# EAGLE design delay_v02 (EAGLE 5.07)
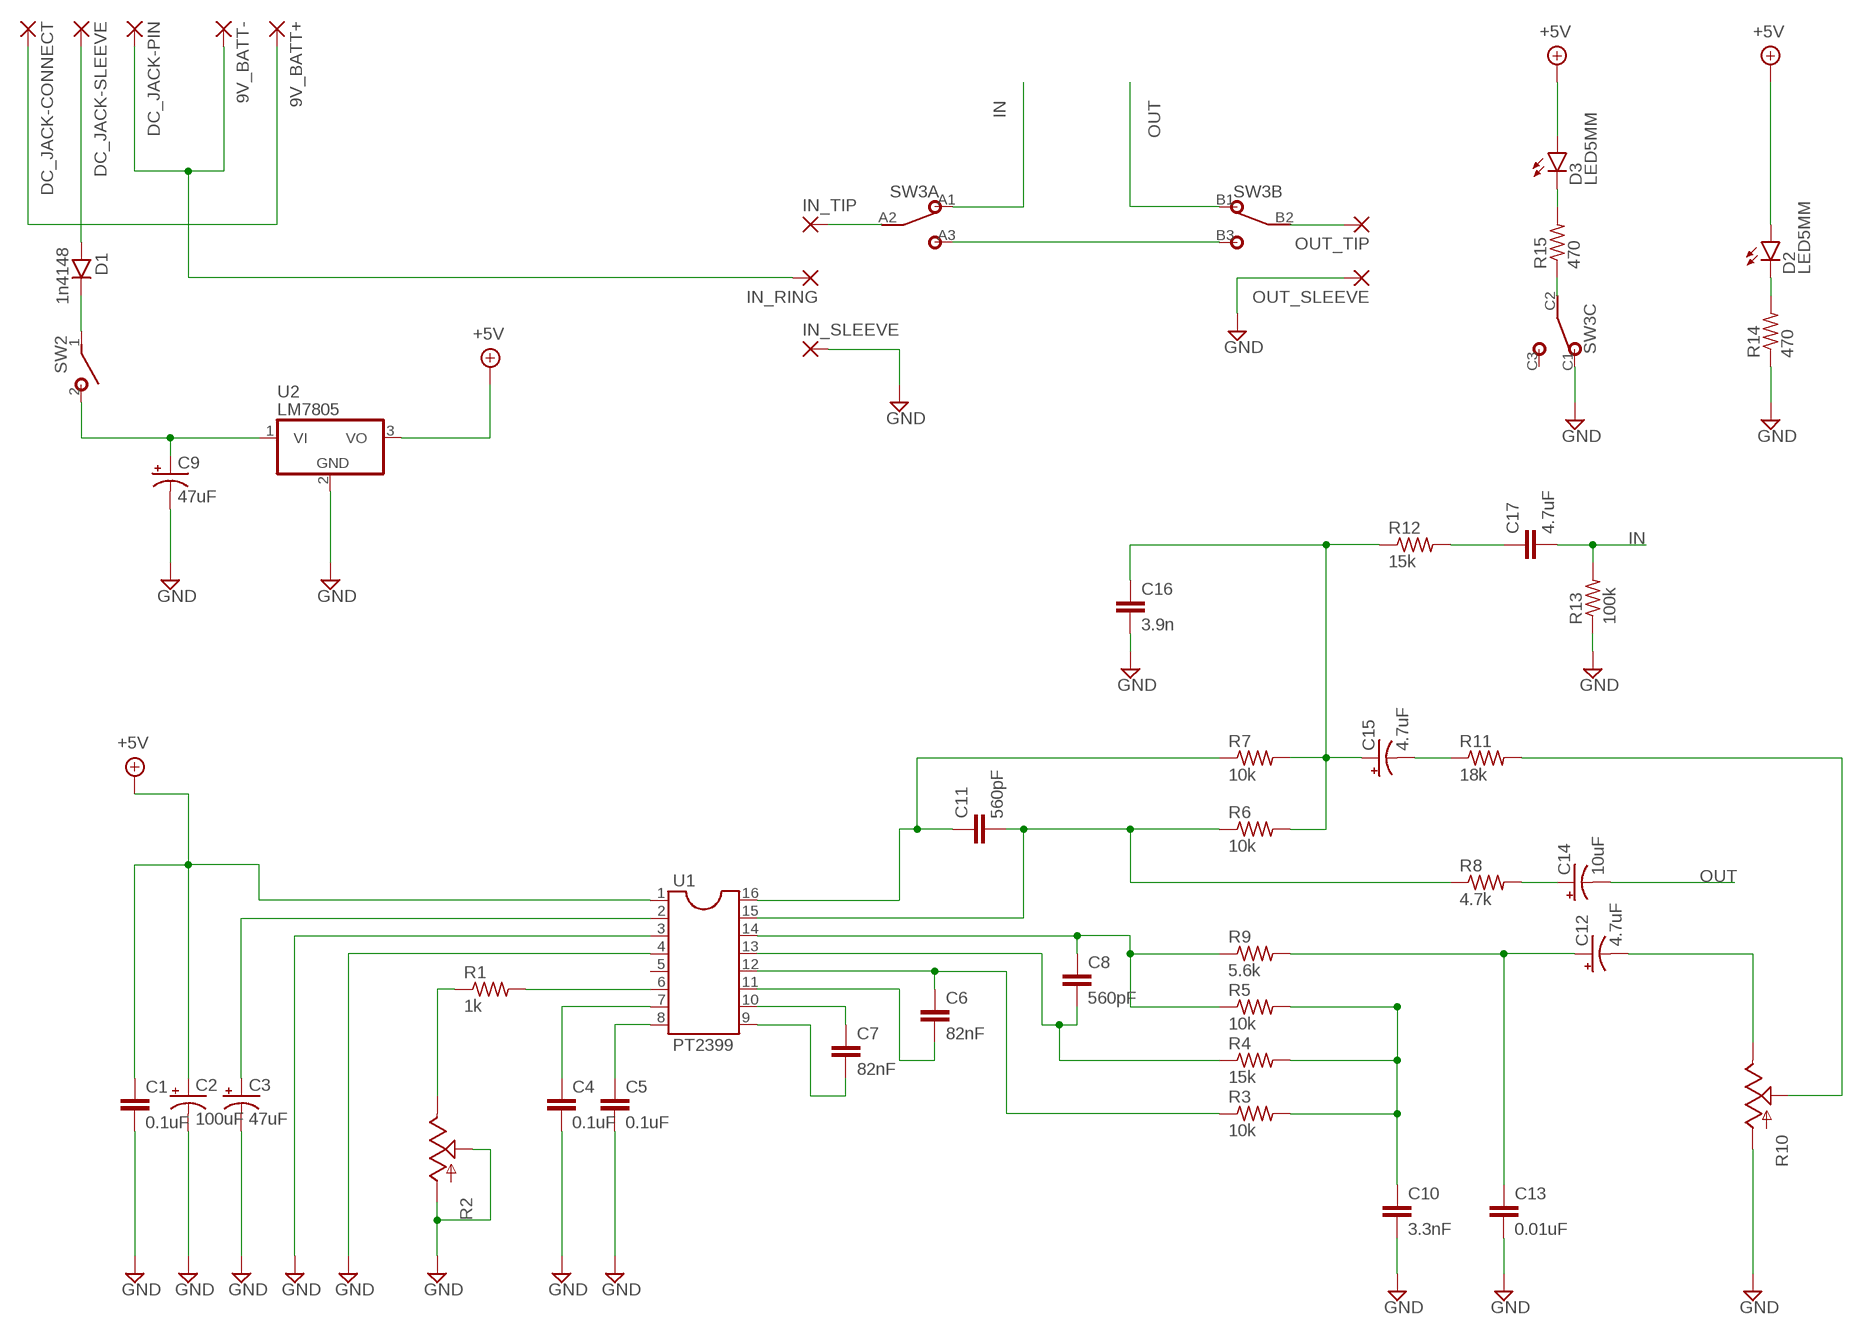
[diagram p0: schematic, sheet 1]

## Parts
9V_BATT+  3,17/1,1  [3,17/1,1]
9V_BATT-  3,17/1,1  [3,17/1,1]
C1  0.1uF  050X030_0251  [050X030_025]
C2  100uF  0631  [063_025]
C3  47uF  0631  [063_025]
C4  0.1uF  050X030_0251  [050X030_025]
C5  0.1uF  050X030_0251  [050X030_025]
C6  82nF  050X030_0251  [050X030_025]
C7  82nF  050X030_0251  [050X030_025]
C8  560pF  050X030_0251  [050X030_025]
C9  47uF  0631  [063_025]
C10  3.3nF  050X030_0251  [050X030_025]
C11  560pF  050X030_0251  [050X030_025]
C12  4.7uF  0631  [063_025]
C13  0.01uF  050X030_0251  [050X030_025]
C14  10uF  0631  [063_025]
C15  4.7uF  0631  [063_025]
C16  3.9n  050X030_0251  [050X030_025]
C17  4.7uF  050X030_0251  [050X030_025]
D1  1n4148  1N400X.3  [DO41-3]
D2  LED5MM  [LED5MM]
D3  LED5MM  [LED5MM]
DC_JACK-CONNECT  3,17/1,1  [3,17/1,1]
DC_JACK-PIN  3,17/1,1  [3,17/1,1]
DC_JACK-SLEEVE  3,17/1,1  [3,17/1,1]
IN_RING  3,17/1,1  [3,17/1,1]
IN_SLEEVE  3,17/1,1  [3,17/1,1]
IN_TIP  3,17/1,1  [3,17/1,1]
OUT_SLEEVE  3,17/1,1  [3,17/1,1]
OUT_TIP  3,17/1,1  [3,17/1,1]
R1  1k  3MM.3  [R0204/3]
R2  50k  POT  [ALPS_POT]
R3  10k  3MM.3  [R0204/3]
R4  15k  3MM.3  [R0204/3]
R5  10k  3MM.3  [R0204/3]
R6  10k  3MM.3  [R0204/3]
R7  10k  3MM.3  [R0204/3]
R8  4.7k  3MM.3  [R0204/3]
R9  5.6k  3MM.3  [R0204/3]
R10  20k  POT  [ALPS_POT]
R11  18k  3MM.3  [R0204/3]
R12  15k  3MM.3  [R0204/3]
R13  100k  3MM.3  [R0204/3]
R14  470  3MM.3  [R0204/3]
R15  470  3MM.3  [R0204/3]
SW2  SPST  [SPST]
SW3  3PDT  [3PDT]
U1  PT2399  DIL16S  [SOCKET-16]
U2  LM7805  78  [TO92-]

## Nets
C5*: C5.1 U1.8
GND: C1.2 C2.- C3.- C4.2 C5.2 C9.- C10.2 C13.2 C16.2 IN_SLEEVE.1(P) OUT_SLEEVE.1(P) R2.P$2(S) R2.P$3(A) R10.P$3(A) R13.1 R14.1 SW3.C1 U1.3 U1.4 U2.2(GND)
IN: C17.2 R13.2 SW3.A1
N$1: C17.1 R12.2
N$2: C4.1 U1.7
N$3: C7.2 U1.9
N$4: C7.1 U1.10
N$5: C10.1 R3.2 R4.2 R5.2
N$6: C6.1 R3.1 U1.12
N$7: R1.2 U1.6
N$8: R1.1 R2.P$1(E)
N$9: C3.+ U1.2
N$10: R15.1 SW3.C2
N$12: C8.2 R4.1 U1.13
N$13: D3.K(C) R15.2
N$14: C11.2 R6.1 R8.1 U1.15
N$15: C11.1 R7.1 U1.16
N$16: C12.+ C13.1 R9.2
N$17: C6.2 U1.11
N$18: SW3.A3 SW3.B3
N$19: C12.- R10.P$1(E)
N$20: C15.+ C16.1 R6.2 R7.2 R12.1
N$21: C15.- R11.1
N$22: R10.P$2(S) R11.2
N$23: OUT_TIP.1(P) SW3.B2
N$24: IN_TIP.1(P) SW3.A2
N$25: C14.+ R8.2
N$26: C8.1 R5.1 R9.1 U1.14
N$29: D2.K(C) R14.2
N$30: D1.A DC_JACK-SLEEVE.1(P)
N$31: D1.C SW2.1(P)
N$32: 9V_BATT-.1(P) DC_JACK-PIN.1(P) IN_RING.1(P)
N$33: 9V_BATT+.1(P) DC_JACK-CONNECT.1(P)
N$34: C9.+ SW2.2(S) U2.1(VI)
OUT: C14.- SW3.B1
VA: C1.1 C2.+ D2.A D3.A U1.1 U2.3(VO) ; supply symbol labelled +5V
Unconnected: SW3.C3 U1.5

## Library data of the parts
9V_BATT+ 9V_BATT- DC_JACK-CONNECT DC_JACK-PIN DC_JACK-SLEEVE IN_RING IN_SLEEVE IN_TIP OUT_SLEEVE OUT_TIP = wirepad:3,17/1,1: THROUGH-HOLE PAD
C1 C4-C8 C10 C11 C13 C16 C17 = gm-caps-ceramic:050X030_025: 47 - 120pF Xicon Ceramic Disc 2.5mm lead spacing
C2 C3 C9 C12 C14 C15 = gm-caps-electro-pol:063: 33 - 220uF Xicon values at Mouser.com 10V: 220uF; 16V: 100uF; 25V: 100uF; 50V: 33uF
D1 = gm-diodes:1N400X: Rectifier Diodes often used in power supply to prevent damage from reverse polarization
D2 D3 = gm-diodes:LED
R1 R3-R9 R11-R15 = gm-resistors:3MM: 3mm Resistors Leads spaced 1-6 holes apart for 0.1" perfboard. Suitable for 1/8 watt resistors.
R2 R10 = SparkFun-3-2-07:POT
SW2 = gm-switches:SPST
SW3 = gm-switches:3PDT
U1 = ic-package:DIL16: Dual In Line / Socket
U2 = gm-regulators:78*: Positive VOLTAGE REGULATOR Source: http://cache.national.com/ds/LM/LM78L05.pdf http://www.fairchildsemi.com/ds/LM/LM7805.pdf

## Board
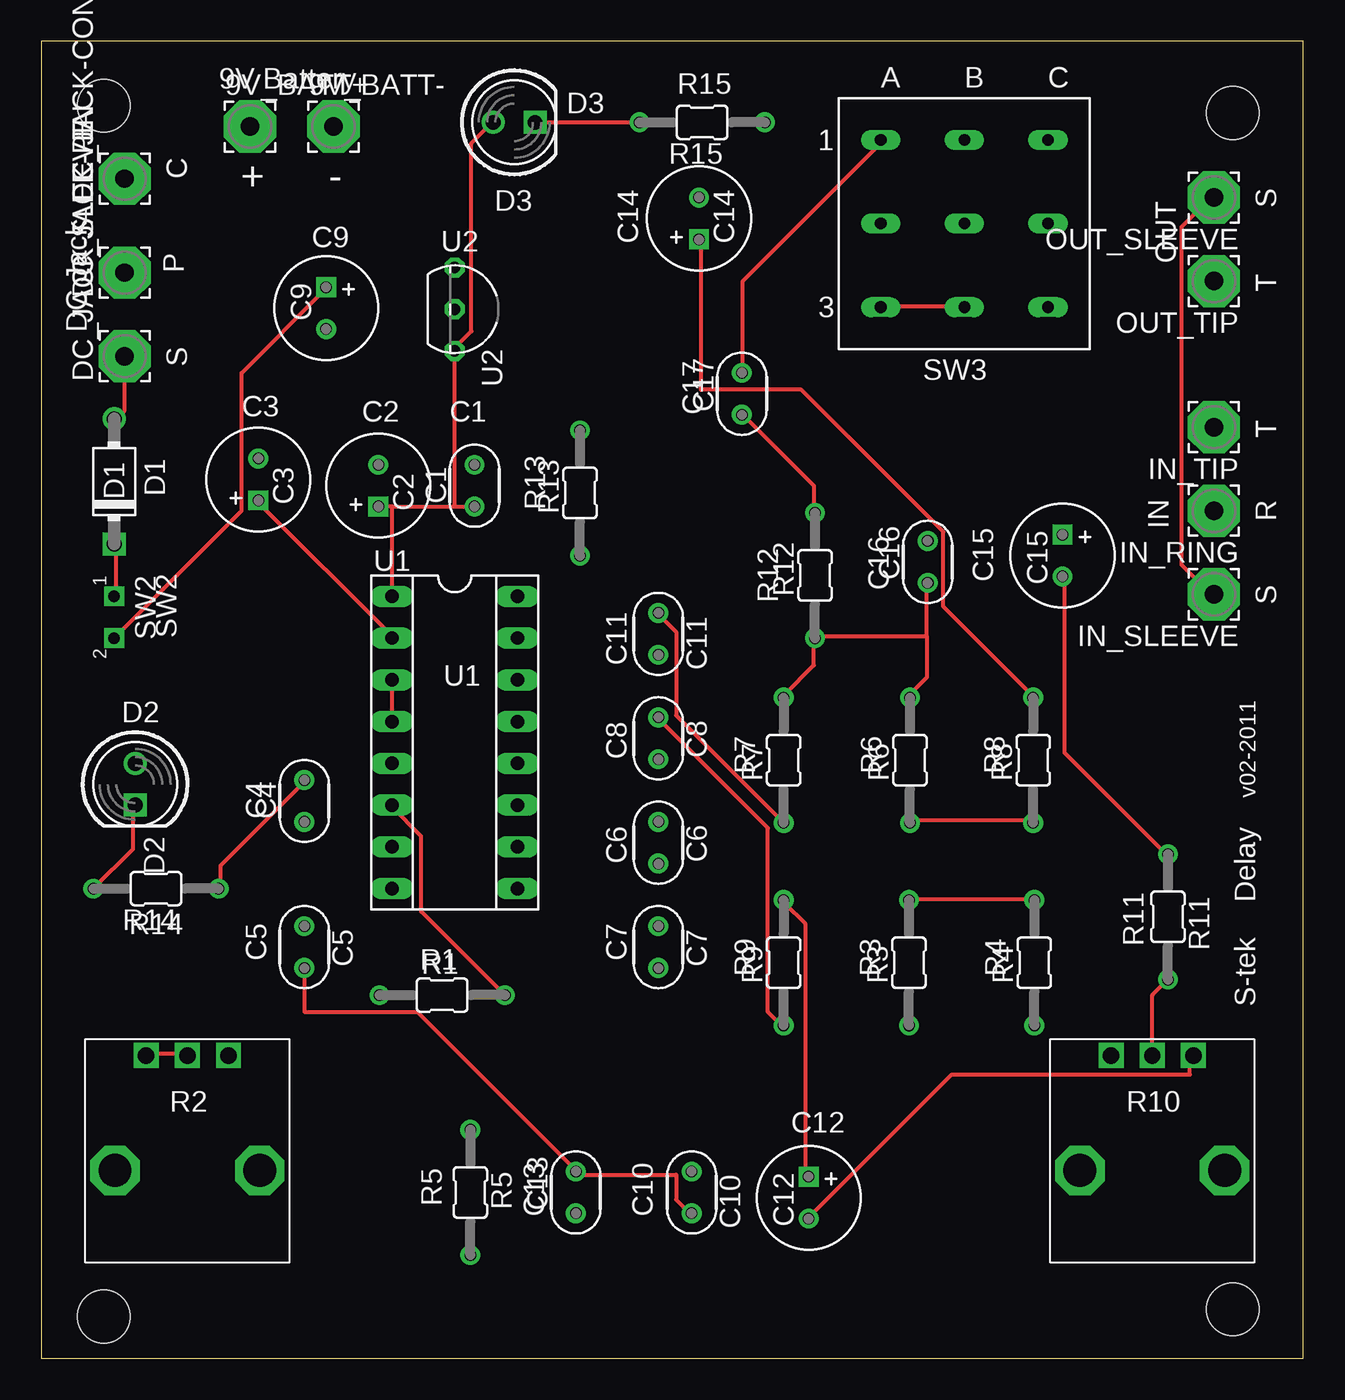
[diagram p1: board, top side]
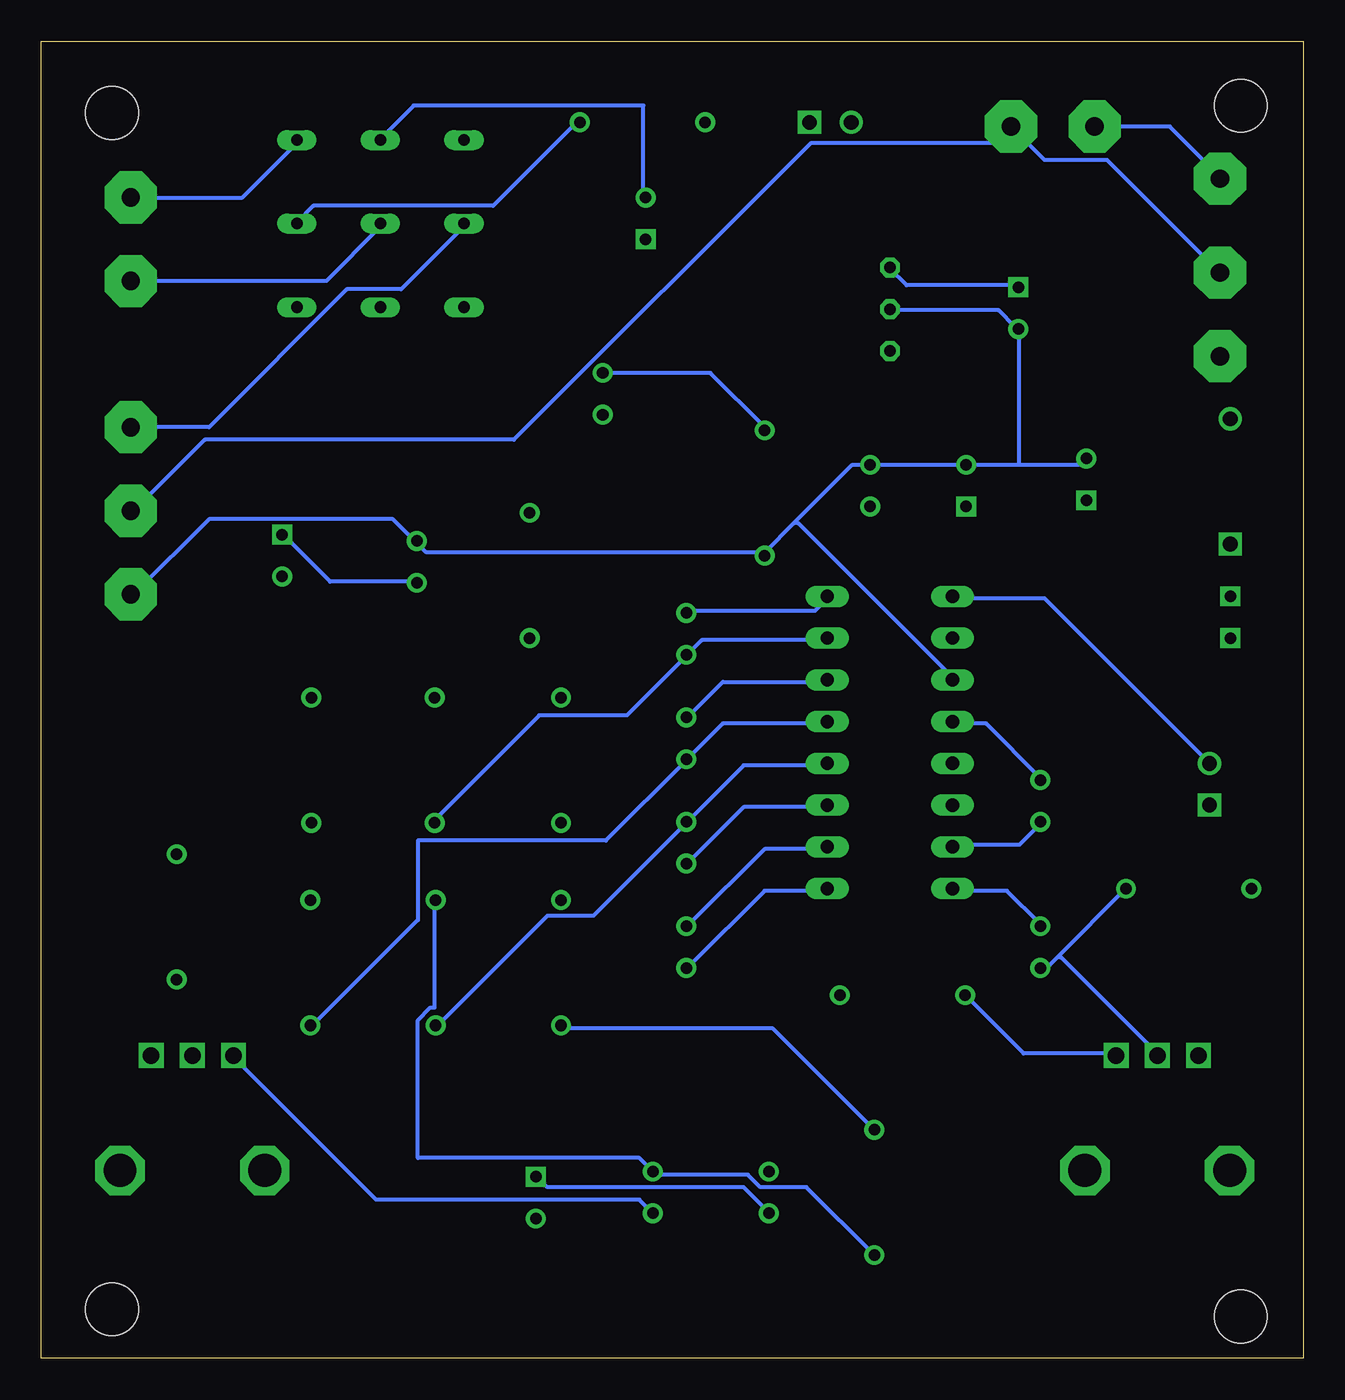
[diagram p2: board, bottom side, seen from below]

Size 76.76 x 80.13 mm. Coordinates in mm from the lower left corner, seen from the top.
Outline: 0,0 76.76,0 76.76,80.13 0,80.13 0,0
Copper layers (1*16): Top 0.035mm / dielectric 1.5mm / Bottom 0.035mm
Design rules "default *": minimum track width 10mil, minimum drill 24mil, track to track 12mil, track to pad 8mil, pad to pad 8mil, via to via 8mil, smd to smd 8mil, copper to edge 40mil, drill to drill 8mil, minimum pad ring 10mil, minimum via ring 8mil, stop-mask expansion 4mil, vias tented up to drill 0mil, thermal gap 10mil
Holes 3.2 mm at 3.81,76.2 72.45,75.76 72.45,2.98 3.81,2.54

### Footprints (pad centres in the part's own frame; a part is rotated, then mirrored left to right if it is on the bottom)
3,17/1,1 = drill 1.118 pad 3.175 octagon: 1 0,0
050X030_025 = drill 0.7 round: 1 -1.27,0; 2 1.27,0
063_025 = drill 0.7 square: + -1.27,0 | drill 0.7 round: - 1.27,0
DO41-3 = drill 0.9 round: A 3.81,0 | drill 0.9 square: C -3.81,0
LED5MM = drill 0.9 round: A -1.27,0 | drill 0.9 square: K 1.27,0
R0204/3 = drill 0.7 round: 1 -3.81,0; 2 3.81,0
ALPS_POT = drill 1 square: P$1 7,-2.5; P$2 7,0; P$3 7,2.5 | drill 2 octagon: P$4 0,-4.4; P$5 0,4.4
SPST = drill 0.7 square: 1 -1.27,0; 2 1.27,0
3PDT = drill 0.7 long: A1 -5.08,5.08; A2 -5.08,0; A3 -5.08,-5.08; B1 0,5.08; B2 0,0; B3 0,-5.08; C1 5.08,5.08; C2 5.08,0; C3 5.08,-5.08
SOCKET-16 = drill 0.813 long: 1 -8.89,-3.81; 2 -6.35,-3.81; 3 -3.81,-3.81; 4 -1.27,-3.81; 5 1.27,-3.81; 6 3.81,-3.81; 7 6.35,-3.81; 8 8.89,-3.81; 9 8.89,3.81; 10 6.35,3.81; 11 3.81,3.81; 12 1.27,3.81; 13 -1.27,3.81; 14 -3.81,3.81; 15 -6.35,3.81; 16 -8.89,3.81
TO92- = drill 0.7 octagon: 1 -2.54,0; 2 0,0; 3 2.54,0

### Placement (x,y rotation side)
9V_BATT+  12.7,74.93 0 top
9V_BATT-  17.78,74.93 0 top
C1  26.35,53.09 90 top
C2  20.51,53.09 90 top
C3  13.21,53.47 90 top
C4  16,33.91 90 top
C5  16,25.02 270 top
C6  37.53,31.37 270 top
C7  37.53,25.02 270 top
C8  37.53,37.72 270 top
C9  17.34,63.88 270 top
C10  39.56,10.1 270 top
C11  37.53,44.07 270 top
C12  46.67,9.78 270 top
C13  32.51,10.1 90 top
C14  40.01,69.34 90 top
C15  62.1,48.83 270 top
C16  53.91,48.45 90 top
C17  42.61,58.67 90 top
D1  4.45,53.34 90 top
D2  5.71,34.92 270 top
D3  28.77,75.18 0 top
DC_JACK-CONNECT  5.08,71.75 90 top
DC_JACK-PIN  5.08,66.04 90 top
DC_JACK-SLEEVE  5.08,60.96 90 top
IN_RING  71.31,51.56 180 top
IN_SLEEVE  71.31,46.48 180 top
IN_TIP  71.31,56.64 180 top
OUT_SLEEVE  71.31,70.61 180 top
OUT_TIP  71.31,65.53 180 top
R1  24.38,22.1 0 top
R2  8.89,11.43 90 top
R3  52.77,24.07 90 top
R4  60.39,24.07 90 top
R5  26.1,10.1 270 top
R6  52.83,36.39 90 top
R7  45.15,36.39 90 top
R8  60.33,36.39 90 top
R9  45.15,24.07 90 top
R10  67.56,11.43 90 top
R11  68.52,26.86 270 top
R12  47.05,47.62 90 top
R13  32.77,52.64 90 top
R14  6.99,28.57 180 top
R15  40.2,75.18 180 top
SW2  4.45,45.09 270 top
SW3  56.13,69.02 0 top
U1  25.15,37.47 270 top
U2  25.15,63.82 270 top

### Tracks (layer width: path | path; a pad name or v marks a point on that pad's centre or on a via)
C5*
  Bottom 0.254: C5.1 16,26.42 18.03,28.45 21.34,28.45 U1.8
GND
  Top 0.254: C10.2 39.37,8.89 38.61,9.65 38.61,11.18 32.51,11.18 C13.2 32.51,11.43 22.86,21.08 16,21.08 C5.2 | U1.4 U1.3 | R2.P$3 6.6,18.54 8.89,18.54 R2.P$2 | C4.2 16,35.05 10.92,29.97 10.92,28.7 R14.1 | OUT_SLEEVE.1 71.12,70.61 69.34,68.83 69.34,48.26 71.12,46.48 IN_SLEEVE.1
  Bottom 0.254: R10.P$3 65.02,18.29 56.39,9.65 40.39,9.65 C10.2 | C4.2 16,35.31 19.3,38.61 21.34,38.61 U1.4 | 14.99,24.38 15.49,23.88 16,23.88 C5.2 | 14.99,24.38 R14.1 | 14.99,24.38 14.73,24.38 8.89,18.54 R2.P$2 | SW3.C1 61.21,73.91 64.52,70.61 OUT_SLEEVE.1 | U2.2 25.15,63.75 18.54,63.75 17.53,62.74 C9.- 17.27,62.48 17.27,54.36 | 17.27,54.36 13.46,54.36 13.21,54.61 C3.- | 17.27,54.36 C2.- C1.2 27.43,54.36 30.99,50.8 | 30.99,50.8 32.77,49.02 | 32.77,49.02 53.34,49.02 53.85,49.53 C16.2 54.1,49.78 55.37,51.05 66.55,51.05 71.12,46.48 IN_SLEEVE.1 | 32.77,49.02 R13.1 | 30.99,50.8 30.73,50.8 21.34,41.4 U1.3
IN
  Top 0.254: SW3.A1 51.05,73.91 42.67,65.53 42.67,59.94 C17.2
  Bottom 0.254: R13.2 32.77,56.64 36.07,59.94 C17.2
N$1
  Top 0.254: C17.1 42.67,57.4 46.99,53.09 46.99,51.56 R12.2
N$2
  Bottom 0.254: C4.1 16,32.51 17.27,31.24 21.34,31.24 U1.7
N$3
  Bottom 0.254: C7.2 37.34,23.88 32.77,28.45 28.96,28.45 U1.9
N$4
  Bottom 0.254: C7.1 37.34,26.42 32.77,30.99 28.96,30.99 U1.10
N$5
  Top 0.254: R3.2 52.83,27.94 60.2,27.94 R4.2
  Bottom 0.254: R5.2 30.23,10.41 33.02,10.41 33.78,11.18 39.37,11.18 C10.1 40.39,12.19 53.85,12.19 53.85,20.57 53.09,21.34 52.83,21.34 52.83,27.69 R3.2
N$6
  Bottom 0.254: U1.12 28.96,36.07 34.04,36.07 37.34,32.77 C6.1 37.59,32.51 43.18,26.92 45.97,26.92 52.58,20.32 R3.1
N$7
  Top 0.254: R1.2 23.11,27.18 23.11,31.75 21.34,33.53 U1.6
N$8
  Bottom 0.254: R1.1 17.02,18.54 11.43,18.54 R2.P$1
N$9
  Top 0.254: C3.+ 13.21,52.07 21.34,43.94 U1.2
N$10
  Bottom 0.254: R15.1 44.2,75.18 49.28,70.1 60.2,70.1 61.21,69.09 SW3.C2
N$12
  Bottom 0.254: U1.13 28.96,38.61 35.31,38.61 37.34,36.58 C8.2 37.59,36.32 42.42,31.5 53.85,31.5 53.85,26.67 60.2,20.32 R4.1
N$13
  Top 0.254: D3.K R15.2
N$14
  Top 0.254: R6.1 52.83,32.77 60.2,32.77 R8.1
  Bottom 0.254: U1.15 28.96,43.69 36.58,43.69 37.34,42.93 C11.2 37.59,42.67 41.15,39.12 46.48,39.12 52.83,32.77 R6.1
N$15
  Top 0.254: R7.1 38.61,39.12 38.61,44.2 37.59,45.21 C11.1
  Bottom 0.254: U1.16 28.96,46.23 29.72,45.47 37.34,45.47 C11.1
N$16
  Top 0.254: R9.2 45.21,27.69 46.48,26.42 46.48,11.18 C12.+
  Bottom 0.254: C13.1 32.51,8.89 34.04,10.41 45.97,10.41 46.48,10.92 C12.+
N$17
  Bottom 0.254: C6.2 37.34,30.23 34.04,33.53 28.96,33.53 U1.11
N$18
  Top 0.254: SW3.A3 51.05,64.01 56.13,64.01 SW3.B3
N$19
  Top 0.254: C12.- 46.74,8.64 55.37,17.27 69.85,17.27 69.85,18.29 R10.P$1
N$20
  Top 0.254: R7.2 45.21,40.39 46.99,42.16 46.99,43.69 R12.1 47.24,43.94 53.85,43.94 | 53.85,43.94 53.85,46.99 C16.1 | 53.85,43.94 53.85,41.4 52.83,40.39 R6.2
  Bottom 0.254: C15.+ 61.98,50.04 59.18,47.24 54.1,47.24 C16.1
N$21
  Top 0.254: R11.1 68.33,30.73 62.23,36.83 62.23,47.5 C15.-
N$22
  Top 0.254: R11.2 67.56,22.1 R10.P$2
N$23
  Bottom 0.254: SW3.B2 56.13,68.83 59.44,65.53 OUT_TIP.1
N$24
  Bottom 0.254: SW3.A2 51.05,68.83 54.86,65.02 58.17,65.02 66.55,56.64 IN_TIP.1
N$25
  Top 0.254: R8.2 60.2,40.39 54.86,45.72 54.86,50.29 46.23,58.93 40.13,58.93 40.13,68.07 C14.+
N$26
  Top 0.254: C8.1 37.59,38.86 44.2,32.26 44.2,21.08 44.96,20.32 R9.1
  Bottom 0.254: C8.1 37.34,39.12 35.31,41.15 28.96,41.15 U1.14 | R5.1 32.26,20.07 44.96,20.07 R9.1
N$29
  Top 0.254: R14.2 5.59,30.99 5.59,33.53 D2.K
N$30
  Top 0.254: DC_JACK-SLEEVE.1 5.08,57.66 4.57,57.15 D1.A
N$31
  Top 0.254: SW2.1 4.57,46.48 4.57,49.53 D1.C
N$32
  Bottom 0.254: DC_JACK-PIN.1 11.94,72.9 15.75,72.9 16.76,73.91 | 16.76,73.91 29.97,73.91 48.01,55.88 66.8,55.88 71.12,51.56 IN_RING.1 | 16.76,73.91 9V_BATT-.1
N$33
  Bottom 0.254: 9V_BATT+.1 8.13,74.93 5.08,71.88 DC_JACK-CONNECT.1
N$34
  Top 0.254: SW2.2 12.19,51.56 12.19,59.94 17.27,65.02 C9.+
  Bottom 0.254: U2.1 25.15,66.29 24.13,65.28 17.53,65.28 C9.+
OUT
  Bottom 0.254: C14.- 40.13,70.61 40.13,76.2 54.1,76.2 56.13,74.17 SW3.B1
VA
  Top 0.254: 21.34,51.82 25.15,51.82 | 21.34,51.82 C2.+ | 25.15,51.82 C1.1 | 25.15,51.82 U2.3 25.15,61.47 26.16,62.48 26.16,73.91 27.43,75.18 D3.A | U1.1 21.34,51.82
  Bottom 0.254: D2.A 15.75,46.23 21.34,46.23 U1.1

### Text on the board
tPlace: 9V Battery | R15 | C | + | - | D3 | S | U2 | C9 | C14 | OUT | P | T | DC Jack | S | C3 | C2 | C1 | C17 | T | R13 | D1 | R | IN | C16 | C15 | R12 | S | SW2 | C11 | U1 | D2 | C8 | R7 | R6 | R8 | v02-2011 | C4 | C6 | Delay | R14 | R1 | R11 | C5 | C7 | R9 | R3 | R4 | S-tek | R2 | R10 | C12 | R5 | C13 | C10